# EAGLE design drawdio (EAGLE 8.2.1)
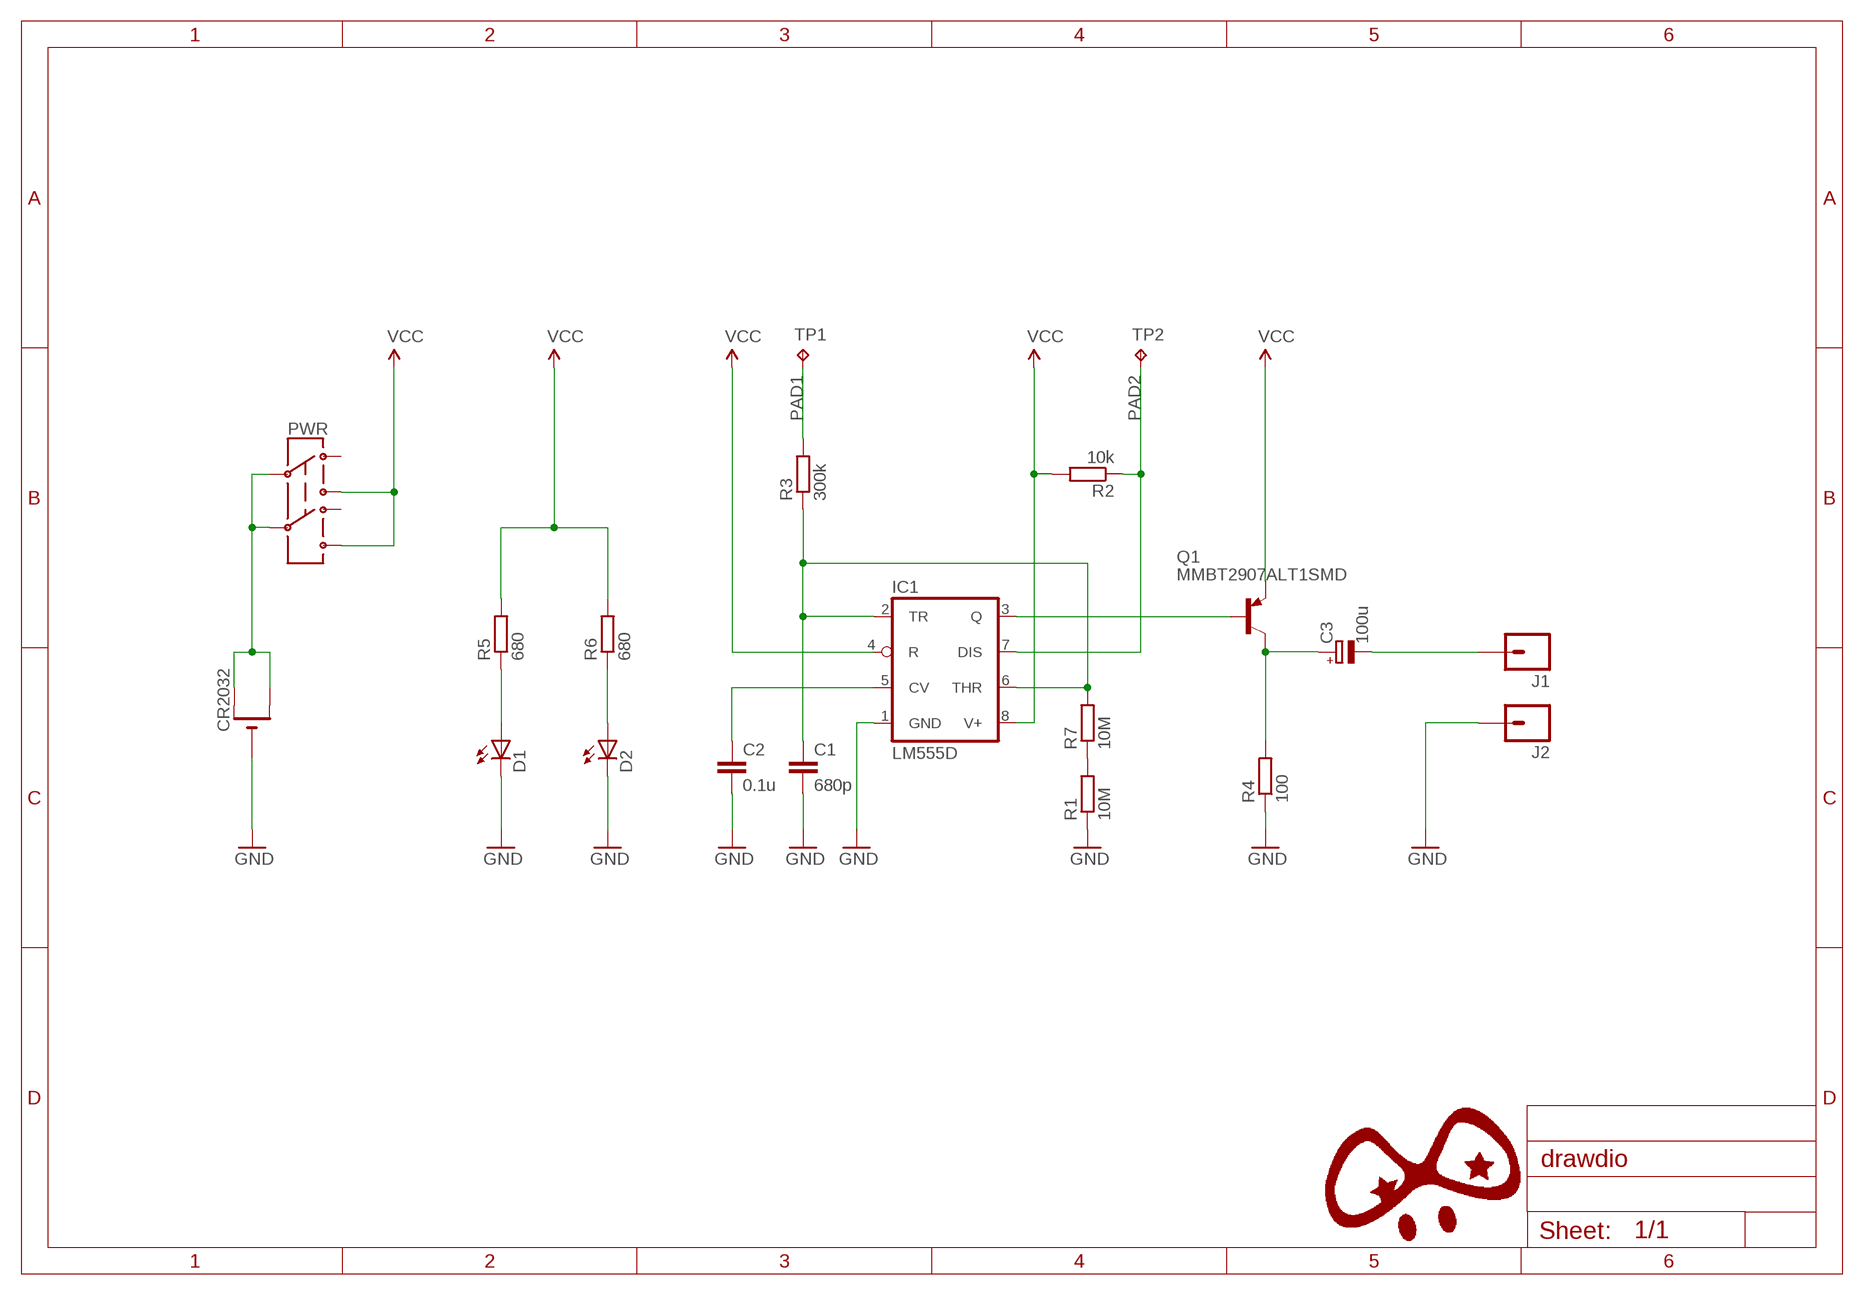
[diagram p0: schematic, sheet 1]

## Parts
C1  680p  C-EUC1206K  [C1206K]
C2  0.1u  C-EUC1206K  [C1206K]
C3  100u  CPOL-EU153CLV-0605  [153CLV-0605]
CR2032  CR2032THM  [CR2032-THRU]
D1  LED-1206  [C1206]
D2  LED-1206  [C1206]
IC1  LM555D  [SO08]
J1  M01NOSILK-KIT  [1X01NS-KIT]
J2  M01NOSILK-KIT  [1X01NS-KIT]
PWR  SWITCH-DPDTOS  [OS]
Q1  MMBT2907ALT1SMD  [SOT23-BEC]
R1  10M  R-EU_R1206W  [R1206W]
R2  10k  R-EU_R1206W  [R1206W]
R3  300k  R-EU_R1206W  [R1206W]
R4  100  R-EU_R1206W  [R1206W]
R5  680  R-EU_R1206W  [R1206W]
R6  680  R-EU_R1206W  [R1206W]
R7  10M  R-EU_R1206W  [R1206W]
TP1  TPB2,54  [B2,54]
TP2  TPB2,54  [B2,54]

## Nets
GND: C1.2 C2.2 CR2032.- D1.C D2.C IC1.1(GND) J2.1 R1.1 R4.1
N$1: C2.1 IC1.5(CV)
N$2: C1.1 IC1.2(TR) IC1.6(THR) R3.1 R7.2
N$3: IC1.3(Q) Q1.B
N$6: C3.+ Q1.C R4.2
N$7: D1.A R5.1
N$8: C3.- J1.1
N$9: D2.A R6.1
N$10: CR2032.+1(+) CR2032.+2(+1) PWR.2 PWR.5
N$11: R1.2 R7.1
PAD1: R3.2 TP1.TP
PAD2: IC1.7(DIS) R2.1 TP2.TP
VCC: IC1.4(R) IC1.8(V+) PWR.3 PWR.6 Q1.E R2.2 R5.2 R6.2
Unconnected: PWR.1 PWR.4

## Library data of the parts
C1 C2 = resistor:C-EU: CAPACITOR, European symbol
C3 = resistor:CPOL-EU: POLARIZED CAPACITOR, European symbol
CR2032 = adafruit:CR2032
D1 D2 = Opto:LED: LEDs red, green, blue -> 0603
IC1 = linear:*555: TIMER
J1 J2 = SparkFun-Connectors:M01: Header 1 Standard 1-pin 0.1" header. Use with straight break away headers (SKU : PRT-00116), right angle break away headers (PRT-00553), swiss pins (PRT-00743), machine pins (PRT-00117), and female headers (PRT-00115). SMTSO-256-ET is a "flush mount" nut for a 4-40 screw. The older package used to be too tight, and did not allow it to sit properly thru the drill hit. The latest (0.165DIA) fits nice and snug.
PWR = SparkFun-Electromechanical:SWITCH-DPDT: DPDT Version of the COM-00597
Q1 = transistor-pnp:MMBT2907*: PNP Transistror
R1-R7 = resistor:R-EU_: RESISTOR, European symbol
TP1 TP2 = testpad:TP: Test pad

## Net classes
0 default: clearance 0.127 mm

## Board
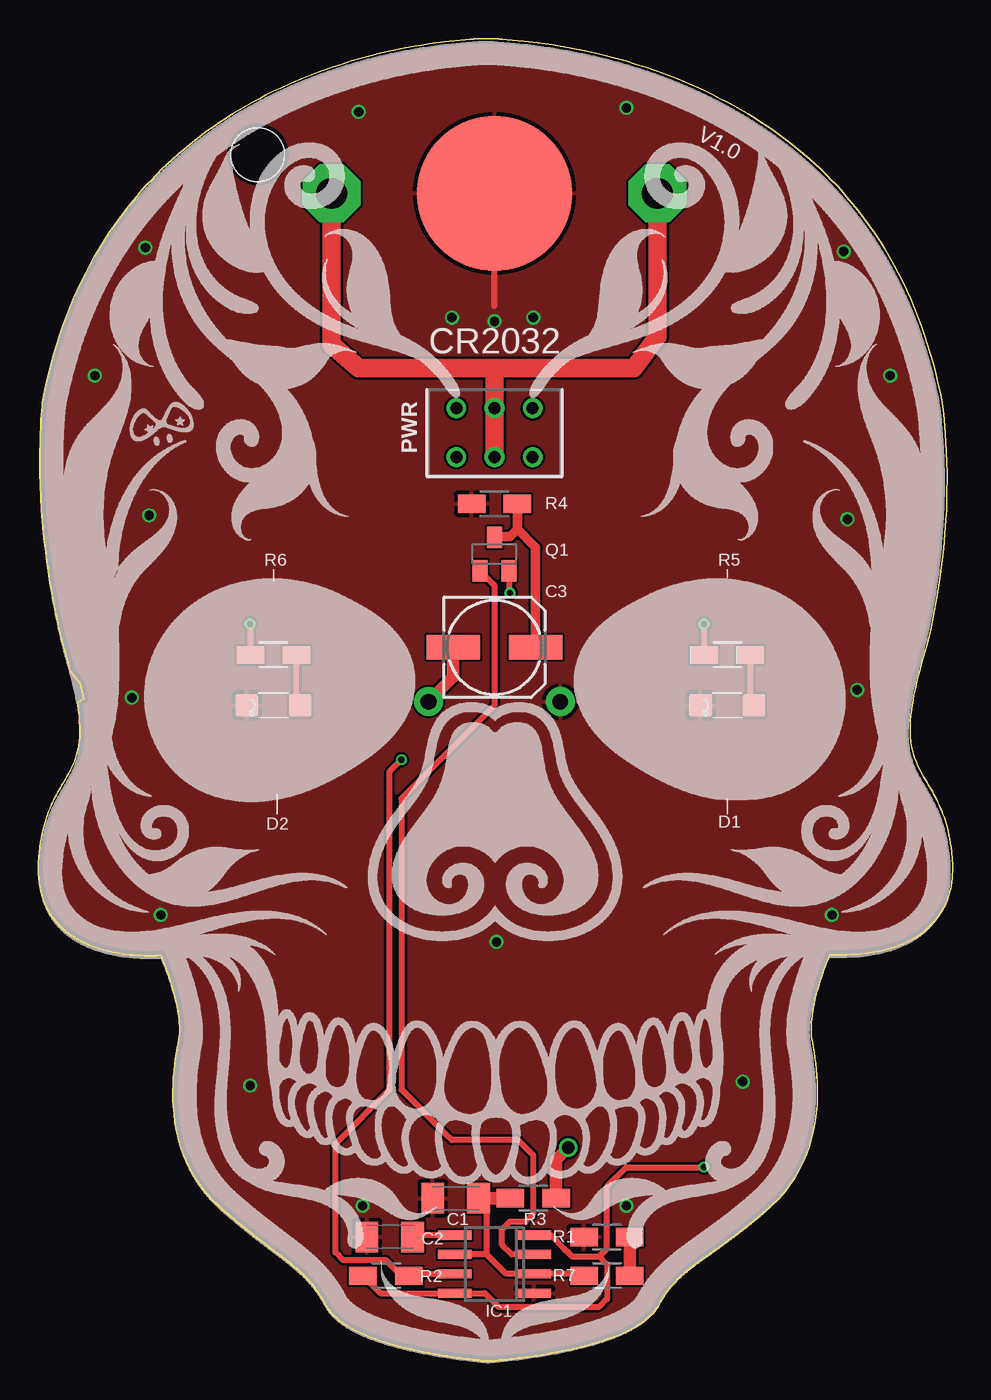
[diagram p1: board, top side]
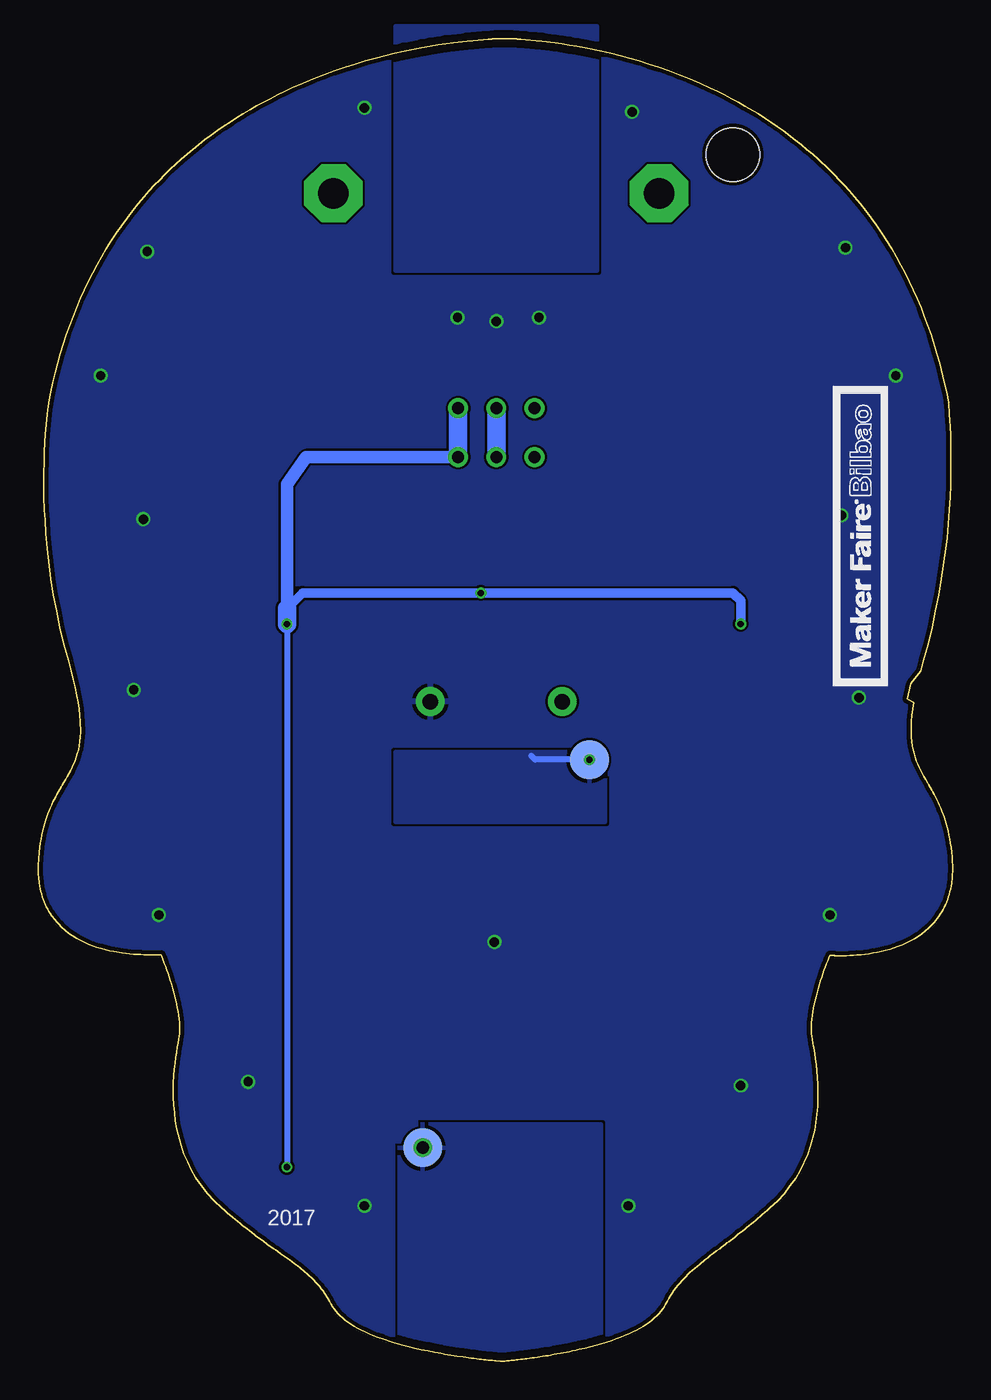
[diagram p2: board, bottom side, seen from below]

Size 59.88 x 86.6 mm. Coordinates in mm from the lower left corner, seen from the top.
Outline: 59.84,32.9 59.81,33.34 59.77,33.64 59.73,33.93 59.69,34.21 59.63,34.47 59.58,34.73 59.52,34.97 59.45,35.2 59.39,35.43 59.31,35.64 59.24,35.85 59.16,36.05 59.08,36.24 59,36.43 58.91,36.61 58.83,36.78 58.74,36.95 58.65,37.12 58.56,37.28 58.47,37.43 58.38,37.59 58.3,37.74 58.21,37.89 58.09,38.09 57.97,38.29 57.75,38.69 57.64,38.9 57.46,39.33 57.37,39.56 57.31,39.8 57.24,40.04 57.19,40.31 57.15,40.6 57.12,40.89 57.1,41.2 57.12,41.9 57.15,42.28 57.21,42.71 57.26,43.14 57.34,43.6 57.46,44.12 57.57,44.64 57.72,45.21 57.89,45.84 58.21,46.95 58.47,48.04 58.68,49.11 58.88,50.18 59.05,51.22 59.29,53.22 59.37,54.18 59.43,55.09 59.48,55.74 59.5,56.59 59.51,58.16 59.5,58.88 59.47,59.52 59.44,60.15 59.4,60.71 59.33,61.64 59.29,62.02 59.26,62.28 59.22,62.55 59.2,62.71 59.19,62.75 59.19,62.75 59.19,62.76 59.19,62.76 59.19,62.76 59.19,62.77 59.19,62.77 59.19,62.78 59.06,63.44 58.92,64.09 58.76,64.73 58.6,65.36 58.42,65.99 58.23,66.6 58.04,67.21 57.83,67.82 57.6,68.4 57.37,68.99 57.12,69.57 56.6,70.69 56.32,71.24 56.03,71.78 55.73,72.32 55.42,72.84 55.09,73.35 54.77,73.87 54.42,74.36 54.06,74.85 53.7,75.33 53.32,75.8 52.93,76.26 52.61,76.63 52.28,76.99 51.94,77.34 51.59,77.69 51.24,78.04 50.88,78.37 50.51,78.7 50.14,79.03 49.37,79.66 48.97,79.97 48.56,80.26 48.16,80.56 47.74,80.85 47.32,81.13 46.89,81.4 46.46,81.67 46.01,81.93 45.57,82.19 45.11,82.44 44.65,82.68 44.19,82.92 43.72,83.15 43.24,83.37 42.54,83.69 41.84,83.98 41.15,84.24 40.46,84.5 39.78,84.73 39.11,84.94 38.45,85.14 37.79,85.32 37.16,85.48 36.53,85.64 35.92,85.77 34.76,86 34.21,86.1 33.69,86.18 33.18,86.26 32.69,86.33 31.81,86.43 31.41,86.47 31.06,86.5 30.71,86.53 30.41,86.55 30.16,86.56 30.16,86.58 30.08,86.58 30.01,86.59 29.93,86.59 29.85,86.59 29.77,86.6 29.69,86.6 29.62,86.6 29.54,86.6 29.47,86.6 29.35,86.6 29.23,86.6 29.11,86.6 28.99,86.59 28.87,86.59 28.76,86.59 28.64,86.58 28.52,86.58 28.52,86.56 28.27,86.55 27.97,86.53 27.29,86.47 26.9,86.43 26.05,86.32 25.59,86.26 25.09,86.18 24.6,86.1 24.07,86 22.95,85.77 22.37,85.63 21.76,85.47 21.16,85.32 20.53,85.14 19.88,84.93 19.24,84.72 18.58,84.49 17.91,84.23 17.24,83.97 16.55,83.69 15.87,83.36 15.4,83.14 14.94,82.91 14.48,82.68 14.03,82.44 13.59,82.19 12.73,81.67 12.3,81.4 11.89,81.12 11.48,80.84 11.08,80.56 10.29,79.96 9.91,79.66 9.54,79.34 9.16,79.03 8.8,78.7 8.09,78.03 7.75,77.69 7.41,77.34 7.08,76.99 6.76,76.63 6.44,76.26 6.05,75.8 5.68,75.33 5.33,74.84 4.97,74.36 4.63,73.86 3.98,72.84 3.68,72.32 3.39,71.78 3.1,71.24 2.82,70.69 2.56,70.13 2.31,69.57 2.07,68.99 1.84,68.4 1.62,67.81 1.41,67.21 1.03,65.99 0.85,65.36 0.53,64.09 0.39,63.44 0.27,62.78 0.27,62.77 0.27,62.76 0.27,62.76 0.27,62.75 0.27,62.74 0.27,62.73 0.27,62.73 0.27,62.72 0.27,62.68 0.25,62.52 0.23,62.25 0.21,61.99 0.18,61.61 0.16,61.15 0.14,60.68 0.12,60.13 0.11,59.49 0.11,58.85 0.11,58.14 0.14,57.35 0.16,56.57 0.21,55.72 0.36,53.91 0.46,53.21 0.73,51.21 0.91,50.17 1.13,49.11 1.34,48.04 1.61,46.95 1.92,45.84 2.1,45.21 2.75,44.39 2.98,43.35 2.56,43.13 2.61,42.7 2.67,42.28 2.7,41.89 2.71,41.54 2.72,41.19 2.71,40.88 2.64,40.3 2.59,40.03 2.52,39.79 2.46,39.54 2.38,39.32 2.29,39.1 2.2,38.89 2.09,38.68 1.98,38.48 1.88,38.28 1.76,38.08 1.64,37.87 1.55,37.73 1.47,37.58 1.38,37.42 1.29,37.27 1.2,37.11 1.03,36.77 0.95,36.6 0.87,36.42 0.78,36.23 0.7,36.04 0.55,35.64 0.48,35.42 0.42,35.19 0.35,34.96 0.29,34.72 0.24,34.46 0.19,34.2 0.14,33.93 0.1,33.63 0.07,33.34 0.04,33.03 0.02,32.7 0,32.49 0,32.28 0,32.08 0.01,31.88 0.02,31.68 0.06,31.3 0.09,31.11 0.13,30.93 0.17,30.75 0.22,30.57 0.27,30.4 0.33,30.23 0.39,30.06 0.46,29.9 0.54,29.74 0.62,29.58 0.71,29.43 0.8,29.28 0.89,29.14 1,29 1.1,28.86 1.22,28.72 1.34,28.59 1.55,28.37 1.78,28.17 2.02,27.99 2.26,27.82 2.51,27.66 3.03,27.39 3.3,27.27 3.57,27.17 3.85,27.07 4.13,26.98 4.4,26.91 4.68,26.84 4.95,26.78 5.22,26.73 5.49,26.68 5.75,26.65 6.01,26.62 6.26,26.6 6.5,26.58 6.73,26.57 6.95,26.56 7.17,26.55 7.39,26.55 7.42,26.55 7.45,26.55 7.49,26.55 7.52,26.55 7.55,26.55 7.58,26.56 7.61,26.56 7.64,26.56 7.67,26.56 7.7,26.56 7.73,26.56 7.76,26.56 7.78,26.56 7.81,26.56 7.84,26.56 7.87,26.56 7.89,26.56 7.92,26.56 7.94,26.57 7.97,26.57 7.99,26.57 8.02,26.57 8.04,26.57 8.11,26.4 8.19,26.22 8.26,26.02 8.34,25.81 8.42,25.6 8.5,25.37 8.58,25.14 8.65,24.9 8.73,24.65 8.8,24.41 8.87,24.16 8.94,23.9 9,23.65 9.06,23.39 9.1,23.14 9.15,22.89 9.19,22.64 9.22,22.4 9.24,22.15 9.25,21.92 9.25,21.7 9.25,21.47 9.23,21.26 9.2,21.07 9.15,20.81 9.09,20.51 9.04,20.16 8.98,19.82 8.93,19.43 8.89,19.01 8.85,18.59 8.82,18.13 8.82,17.66 8.81,17.18 8.84,16.68 8.89,16.17 8.95,15.66 9.04,15.13 9.31,14.08 9.5,13.54 9.98,12.5 10.28,11.98 10.65,11.48 11.02,10.98 11.45,10.49 11.97,10.03 12.13,9.89 12.29,9.75 12.44,9.62 12.6,9.49 12.75,9.36 12.9,9.24 13.04,9.11 13.19,8.99 13.33,8.88 13.47,8.76 13.61,8.65 13.88,8.44 14.01,8.33 14.14,8.23 14.27,8.13 14.4,8.03 14.53,7.93 14.65,7.84 14.77,7.74 14.9,7.65 15.02,7.56 15.13,7.47 15.25,7.38 15.46,7.22 15.66,7.07 15.85,6.93 16.04,6.78 16.22,6.64 16.56,6.36 16.73,6.23 16.88,6.09 17.04,5.96 17.19,5.82 17.33,5.69 17.47,5.55 17.61,5.41 17.74,5.26 17.87,5.12 17.99,4.97 18.11,4.81 18.23,4.65 18.35,4.48 18.46,4.31 18.58,4.13 18.69,3.94 18.79,3.74 18.88,3.58 18.98,3.43 19.1,3.28 19.23,3.13 19.37,2.98 19.53,2.84 19.69,2.7 19.86,2.56 20.06,2.43 20.26,2.3 20.47,2.17 20.71,2.05 20.94,1.92 21.2,1.8 21.47,1.69 21.75,1.58 22.04,1.47 22.35,1.36 22.66,1.25 23,1.15 23.35,1.05 23.7,0.96 24.07,0.86 24.46,0.77 24.67,0.73 24.88,0.68 25.09,0.64 25.29,0.6 25.49,0.56 25.69,0.52 25.89,0.48 26.09,0.45 26.47,0.38 26.66,0.35 26.84,0.32 27.02,0.29 27.2,0.27 27.37,0.24 27.54,0.22 27.7,0.2 27.86,0.18 28.02,0.16 28.17,0.14 28.31,0.12 28.45,0.1 28.58,0.09 28.7,0.08 28.91,0.06 29.01,0.05 29.21,0.03 29.31,0.02 29.51,0 29.61,0.01 29.91,0.04 30.01,0.05 30.11,0.05 30.32,0.07 30.44,0.08 30.57,0.1 30.71,0.11 30.86,0.13 31.01,0.15 31.34,0.19 31.51,0.21 31.69,0.23 31.87,0.26 32.06,0.28 32.45,0.34 32.65,0.37 32.86,0.4 33.06,0.44 33.27,0.47 33.49,0.51 33.7,0.55 33.92,0.59 34.36,0.68 34.59,0.72 34.81,0.77 35.22,0.86 35.61,0.95 35.97,1.05 36.34,1.15 36.68,1.25 37.33,1.46 37.64,1.57 37.92,1.69 38.21,1.8 38.47,1.92 38.71,2.04 38.96,2.17 39.18,2.29 39.59,2.56 39.77,2.7 39.94,2.84 40.1,2.98 40.24,3.13 40.37,3.28 40.49,3.43 40.6,3.58 40.68,3.74 40.78,3.93 40.89,4.11 41.11,4.44 41.22,4.6 41.34,4.75 41.46,4.91 41.59,5.05 41.72,5.19 41.85,5.33 41.99,5.46 42.13,5.6 42.28,5.73 42.43,5.86 42.74,6.11 42.91,6.24 43.08,6.37 43.25,6.5 43.43,6.64 43.62,6.77 43.81,6.91 44,7.05 44.21,7.19 44.34,7.29 44.47,7.38 44.61,7.48 44.74,7.58 44.88,7.67 45.16,7.88 45.3,7.98 45.45,8.09 45.59,8.2 45.74,8.31 46.04,8.54 46.19,8.66 46.51,8.91 46.67,9.04 46.83,9.17 46.99,9.3 47.16,9.44 47.5,9.73 47.67,9.88 47.85,10.04 48.37,10.5 48.81,10.99 49.56,12.01 49.86,12.53 50.1,13.07 50.34,13.6 50.53,14.14 50.81,15.21 50.9,15.74 50.95,16.26 51.01,16.78 51.03,17.28 51.03,17.76 51.02,18.23 51,18.68 50.96,19.1 50.92,19.51 50.87,19.89 50.82,20.23 50.77,20.56 50.71,20.84 50.67,21.07 50.63,21.26 50.62,21.48 50.61,21.7 50.61,21.92 50.63,22.16 50.65,22.4 50.68,22.65 50.72,22.9 50.76,23.15 50.81,23.41 50.87,23.67 51,24.18 51.07,24.43 51.15,24.68 51.22,24.92 51.3,25.17 51.38,25.4 51.46,25.62 51.54,25.84 51.61,26.05 51.69,26.25 51.77,26.44 51.84,26.6 51.86,26.6 51.88,26.6 51.91,26.6 51.93,26.6 51.96,26.6 51.99,26.6 52.01,26.6 52.04,26.6 52.07,26.6 52.09,26.6 52.12,26.6 52.15,26.61 52.18,26.61 52.21,26.61 52.24,26.61 52.27,26.61 52.3,26.61 52.36,26.61 52.39,26.62 52.42,26.62 52.46,26.62 52.49,26.62 52.71,26.62 52.92,26.62 53.15,26.63 53.38,26.64 53.62,26.66 53.87,26.68 54.13,26.71 54.39,26.74 54.93,26.83 55.2,26.88 55.75,27.02 56.03,27.11 56.3,27.21 56.58,27.31 56.85,27.43 57.11,27.56 57.37,27.7 57.62,27.85 57.86,28.03 58.1,28.2 58.33,28.4 58.54,28.62 58.66,28.75 58.77,28.89 58.99,29.17 59.08,29.31 59.17,29.46 59.26,29.61 59.34,29.76 59.41,29.92 59.49,30.08 59.55,30.25 59.6,30.42 59.66,30.59 59.71,30.76 59.74,30.94 59.78,31.12 59.81,31.3 59.86,31.68 59.87,31.88 59.87,32.08 59.88,32.28 59.87,32.49 59.84,32.9
Copper layers (1*16): Top 0.035mm / dielectric 1.5mm / Bottom 0.035mm
Design rules "pighixxx_CAM_DRC_V1.0": minimum track width 6mil, minimum drill 12mil, track to track 6mil, track to pad 6mil, pad to pad 6mil, via to via 6mil, smd to smd 0mil, copper to edge 10mil, drill to drill 10mil, minimum pad ring 10mil, minimum via ring 6mil, stop-mask expansion 2mil, vias tented up to drill 100mil, thermal gap 10mil
Holes 3.5 mm at 14.38,79.01

### Footprints (pad centres in the part's own frame; a part is rotated, then mirrored left to right if it is on the bottom)
C1206K = smd 1.5 x 2: 1 -1.5,0; 2 1.5,0
153CLV-0605 = smd 3.5 x 1.6: + 2.7,0; - -2.7,0
CR2032-THRU = drill 2 pad 3.81 octagon: +1 -10.668,0; +2 10.668,0 | smd 10.16 x 10.16: - 0,0
C1206 = smd 1.5 x 1.5: A 0,-1.75; C 0,1.75
SO08 = smd 0.6 x 2.2: 1 -1.905,-2.6; 2 -0.635,-2.6; 3 0.635,-2.6; 4 1.905,-2.6; 5 1.905,2.6; 6 0.635,2.6; 7 -0.635,2.6; 8 -1.905,2.6
1X01NS-KIT = drill 1.016 pad 1.88: 1 0,0
OS = drill 0.787 pad 1.27: 1 -2.5,1.676; 2 0,1.676; 3 2.5,1.676; 4 -2.5,-1.524; 5 0,-1.524; 6 2.5,-1.524
SOT23-BEC = smd 1 x 1.4: B -0.95,-1.1; C 0,1.1; E 0.95,-1.1
R1206W = smd 1.8 x 1.2: 1 -1.499,0; 2 1.499,0
B2,54 = smd 2.54 x 2.54: TP 0,0

### Placement (x,y rotation side)
C1  27.34,10.68 180 top
C2  23.02,8.14 180 top
C3  29.88,46.75 0 top
CR2032  29.88,76.47 0 top
D1  45.12,42.94 90 top
D2  15.4,42.94 90 top
IC1  29.88,6.37 90 top
J1  25.56,43.2 0 top
J2  34.2,43.2 0 top
PWR  29.88,60.72 0 top
Q1  29.88,52.85 0 top
R1  37.24,8.14 0 top
R2  22.77,5.6 180 top
R3  32.42,10.68 0 top
R4  29.88,56.15 0 top
R5  45.12,46.24 180 top
R6  15.4,46.24 180 top
R7  37.24,5.6 180 top
TP1  34.7,13.99 180 bottom
TP2  23.78,39.39 0 bottom
U$1  [PIGHIXXX_LOGO]  6,59.96 0 top
U$2  [SKULL_TOP]  -0.09,-0.24 0 top
U$3  [SKULL_BOTTOM]  -0.12,43.15 0 top
U$4  [MFBILBAO]  3.97,43.96 90 bottom

### Tracks (layer width: path | path; a pad name or v marks a point on that pad's centre or on a via)
GND  (via drill 0.61)
  Top 0.406: 29.88,69.1 CR2032.-
  other vias: 7.02,72.91 52.74,72.66 3.72,64.53 55.79,64.53 20.99,81.8 38.51,82.06 27.08,68.34 29.88,68.09 32.42,68.34 21.24,10.18 13.88,18.05 46.13,18.3 8.03,29.23 51.98,29.23 30,27.45 53.63,43.96 6.13,43.45 7.27,55.39 52.99,55.13 38.51,10.18
  pour Top: -0.09,-0.24 -0.09,87.14 59.6,87.14 59.6,-0.24
  pour Bottom (rank 2): -0.09,87.14 59.6,87.14 59.6,86.88 59.6,-0.24 -0.09,-0.24
N$1
  Top 0.406: C2.1 24.65,8.27 IC1.5
N$2
  Top 0.406: R7.2 35.62,5.73 IC1.2 30.64,5.73 29.37,7 | 29.37,7 IC1.6 | C1.1 29.37,10.15 29.37,7
  Top 0.813: R3.1 C1.1
N$3
  Top 0.406: IC1.3 31.02,7 30.39,7.64 30.39,8.65 30.89,9.16 31.91,9.16 32.42,9.67 32.42,13.48 31.4,14.49 27.08,14.49 | Q1.B 29.88,50.8 29.88,42.94 23.78,36.85 23.78,17.8 26.7,14.88 | 26.7,14.88 27.08,14.49 | 27.08,14.49 26.7,14.88
N$6
  Top 0.61: 31.38,54.47 R4.2 | 31.38,54.47 30.89,53.99 29.92,53.99 Q1.C | C3.+ 32.58,53.27 31.38,54.47
N$7
  Top 0.406: R5.1 46.62,43.19 D1.A
N$8
  Top 0.813: C3.- 27.18,44.81 J1.1
N$9
  Top 0.406: R6.1 16.9,43.19 D2.A
N$10
  Top 1.219: CR2032.+2 40.55,67.07 39.02,65.04 29.88,65.04 | 29.88,65.04 20.99,65.04 19.21,66.56 CR2032.+1 | PWR.5 29.88,65.04
  Bottom 1.219: PWR.5 PWR.2
N$11
  Top 0.813: R1.2 R7.1
PAD1  (via drill 0.81)
  Top 0.813: R3.2 33.92,13.2 TP1.TP
  other vias: 34.7,13.99
  pour Bottom (isolate 0.508): 23.02,15.51 23.02,-0.24 36.23,-0.24 36.23,15.51
PAD2  (via drill 0.41)
  Top 0.406: R2.1 24.39,5.73 IC1.7 | R2.1 24.04,5.6 | TP2.TP 23.02,38.62 23.02,17.8 19.46,14.24 19.46,7.13 19.97,6.62 22.77,6.62 23.78,5.6 R2.1
  Bottom 0.406: TP2.TP 27.34,39.39 27.59,39.64
  other vias: 23.78,39.39
  pour Bottom (isolate 0.508): 22.77,39.89 22.77,35.32 36.48,35.32 36.48,39.89
PADNULL
  pour Bottom (isolate 0.508): 23.27,81.04 23.27,71.39 30.89,71.39 36.48,71.39 36.48,87.39 23.27,87.39
VCC  (via drill 0.41)
  Top 0.406: R5.2 43.59,46.27 v43.59,48.28 | 30.89,51.68 Q1.E 30.83,50.37 v30.89,50.31 | R6.2 13.9,48.25 v13.88,48.28 | R2.2 22.41,4.46 IC1.8 29.24,4.46 30.13,3.57 36.74,3.57 37.24,4.08 37.24,6.37 36.74,6.87 | IC1.4 33.56,8.27 34.44,7.39 34.44,7.38 34.68,7.14 34.69,7.14 34.96,6.87 36.74,6.87 | 36.74,6.87 37.24,7.38 37.24,11.45 38.51,12.72 v43.59,12.72
  Bottom 0.406: v43.59,48.28 v43.59,12.72
  Bottom 0.61: 43.59,49.29 42.58,50.31 v30.89,50.31 14.38,50.31 13.88,49.8 v13.88,48.28
  Bottom 0.813: PWR.6 42.32,59.2 43.59,57.42 43.59,49.29
  Bottom 1.219: PWR.3 PWR.6 | 43.59,49.29 v43.59,48.28

### Text on the board
tPlace: V1.0
bPlace: 2017